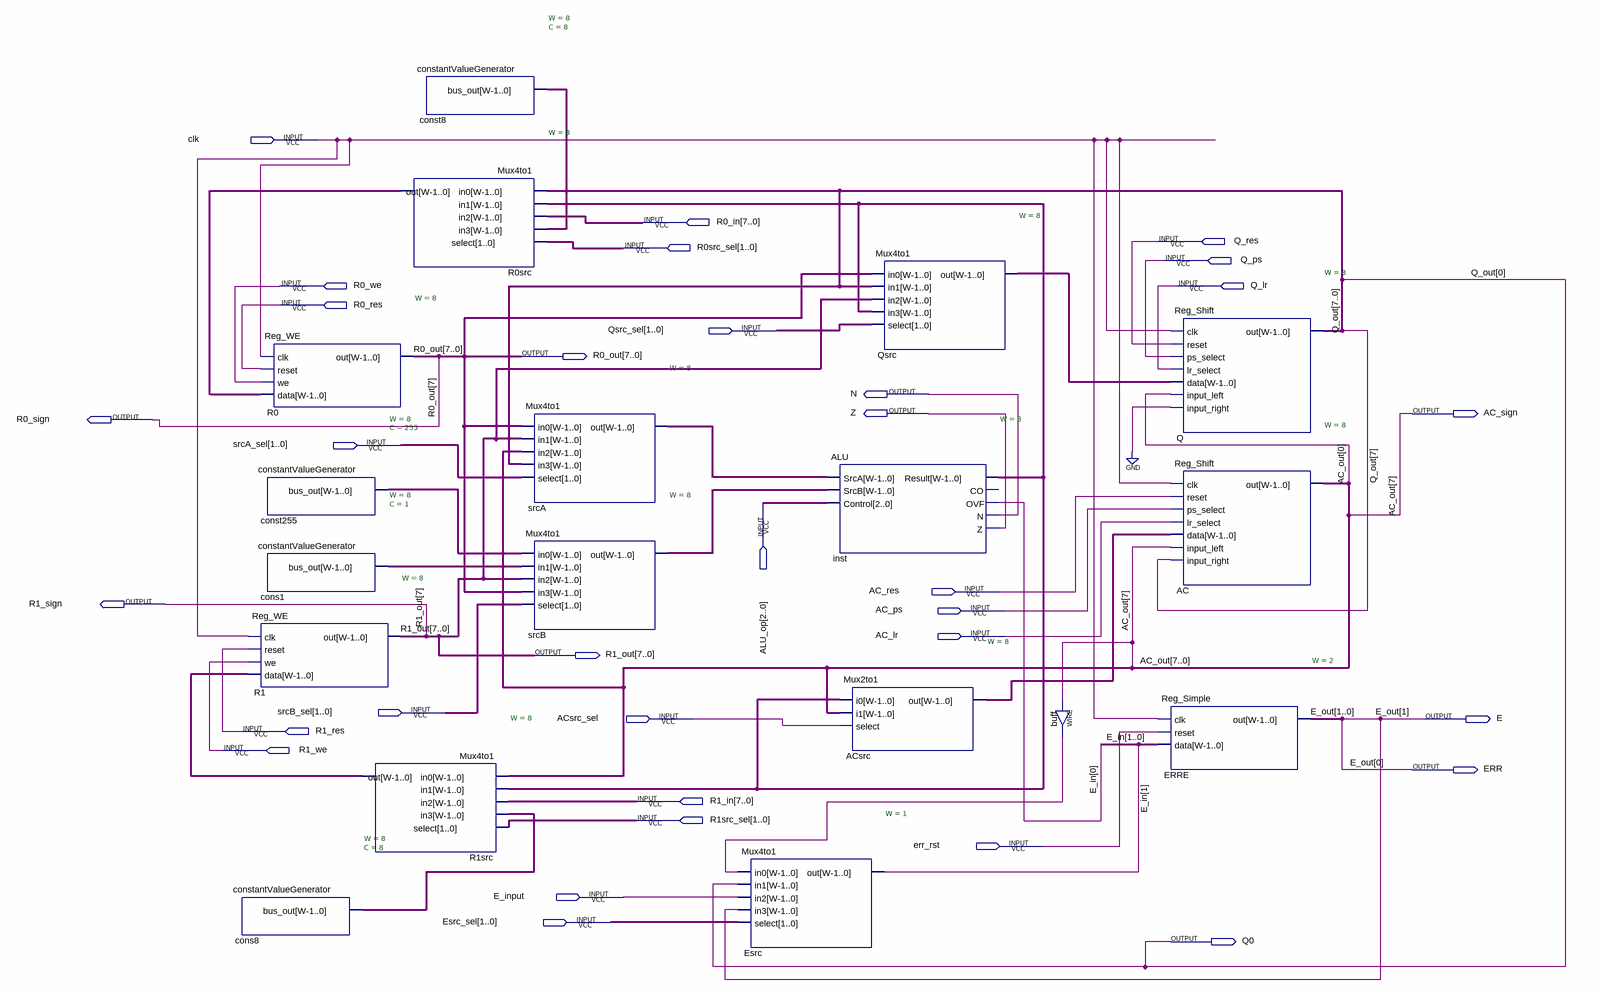
[diagram p0: schematic sheet]
// Quartus schematic datapath.bdf as structural Verilog: 18 symbols, 33 pins
module datapath (
  input  clk,
  input  [7:0] R0_in,
  input  Q_res,
  input  [1:0] R0src_sel,
  input  Q_ps,
  input  R0_we,
  input  Q_lr,
  input  R0_res,
  input  [1:0] Qsrc_sel,
  input  [1:0] srcA_sel,
  input  [2:0] ALU_op,
  input  AC_res,
  input  AC_ps,
  input  AC_lr,
  input  [1:0] srcB_sel,
  input  ACsrc_sel,
  input  R1_res,
  input  R1_we,
  input  [7:0] R1_in,
  input  [1:0] R1src_sel,
  input  err_rst,
  input  E_input,
  input  [1:0] Esrc_sel,
  output [7:0] R0_out,
  output N,
  output Z,
  output AC_sign,
  output R0_sign,
  output R1_sign,
  output [7:0] R1_out,
  output E,
  output ERR,
  output Q0
);

  wire buff_out;
  wire [1:0] E_in;
  wire [6:0] AC_out;
  wire [7:0] ACsrc_out, cons1_bus_out, cons8_bus_out, const8_bus_out, const255_bus_out, inst_result,
       Qsrc_out, R0src_out, R1src_out, srcA_out, srcB_out;
  wire [7:1] Q_out;

  Reg_WE #(.W(8)) R0 (.clk(clk), .reset(R0_res), .we(R0_we), .data(R0src_out), .out(R0_out));
  constantValueGenerator #(.W(8), .C(255)) const255 (.bus_out(const255_bus_out));
  constantValueGenerator #(.W(8), .C(1)) cons1 (.bus_out(cons1_bus_out));
  Reg_WE #(.W(8)) R1 (.clk(clk), .reset(R1_res), .we(R1_we), .data(R1src_out), .out(R1_out));
  constantValueGenerator #(.W(8), .C(8)) cons8 (.bus_out(cons8_bus_out));
  Mux4to1 #(.W(8)) R1src (
    .in0({AC_sign, AC_out}), .in1(inst_result), .in2(R1_in), .in3(cons8_bus_out), .select(R1src_sel),
    .out(R1src_out));
  constantValueGenerator #(.W(8), .C(8)) const8 (.bus_out(const8_bus_out));
  Mux4to1 #(.W(8)) R0src (
    .in0({Q_out, Q0}), .in1(inst_result), .in2(R0_in), .in3(const8_bus_out), .select(R0src_sel),
    .out(R0src_out));
  Mux4to1 #(.W(8)) srcA (
    .in0(R0_out), .in1(R1_out), .in2({AC_sign, AC_out}), .in3({Q_out, Q0}), .select(srcA_sel), .out(srcA_out));
  Mux4to1 #(.W(8)) srcB (
    .in0(const255_bus_out), .in1(cons1_bus_out), .in2(R1_out), .in3(R0_out), .select(srcB_sel), .out(srcB_out));
  Mux4to1 #(.W(1)) Esrc (.in0(buff_out), .in1(Q0), .in2(E_input), .in3(E), .select(Esrc_sel), .out(E_in[1]));
  ALU #(.W(8)) inst (
    .SrcA(srcA_out), .SrcB(srcB_out), .Control(ALU_op), .Result(inst_result), .OVF(E_in[0]), .N(N), .Z(Z));  // open: CO
  Mux4to1 #(.W(8)) Qsrc (
    .in0(R0_out), .in1({Q_out, Q0}), .in2(R1_out), .in3(inst_result), .select(Qsrc_sel), .out(Qsrc_out));
  Mux2to1 #(.W(8)) ACsrc (.i0(inst_result), .i1({AC_sign, AC_out}), .select(ACsrc_sel), .out(ACsrc_out));
  assign buff_out = AC_sign;  // WIRE buff
  Reg_Shift #(.W(8)) Q (
    .clk(clk), .reset(Q_res), .ps_select(Q_ps), .lr_select(Q_lr), .data(Qsrc_out), .input_left(AC_out[0]),
    .input_right(1'b0), .out({Q_out, Q0}));
  Reg_Shift #(.W(8)) AC (
    .clk(clk), .reset(AC_res), .ps_select(AC_ps), .lr_select(AC_lr), .data(ACsrc_out), .input_left(AC_sign),
    .input_right(Q_out[7]), .out({AC_sign, AC_out}));
  Reg_Simple #(.W(2)) ERRE (.clk(clk), .reset(err_rst), .data(E_in), .out({E, ERR}));

  assign R0_sign = R0_out[7];
  assign R1_sign = R1_out[7];

  // Other names for the same wires on the sheet: AC_out[7] = AC_sign; E_out[1:0] = {E, ERR}; Q_out[0] = Q0
endmodule
